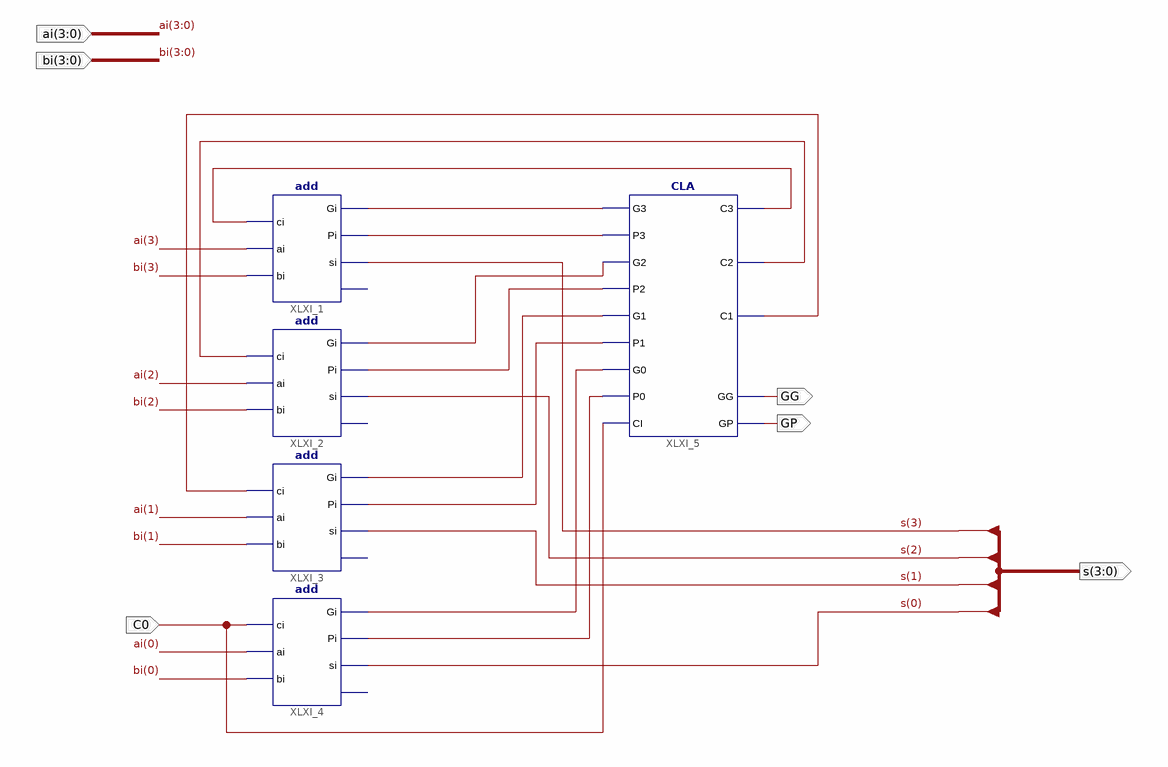
[diagram p0: schematic sheet 1]
// Xilinx ISE schematic ADD4b.sch (kintex7) as structural Verilog: 5 symbols, 6 ports
module ADD4b (
  input  [3:0] bi,
  input  [3:0] ai,
  input  C0,
  output [3:0] s,
  output GG,
  output GP
);

  wire XLXN_35, XLXN_36, XLXN_37, XLXN_38, XLXN_39, XLXN_40, XLXN_41, XLXN_49, XLXN_50, XLXN_51, XLXN_52;

  add XLXI_1 (.Gi(XLXN_35), .Pi(XLXN_36), .si(s[3]), .ai(ai[3]), .bi(bi[3]), .ci(XLXN_37));  // open: co
  add XLXI_2 (.Gi(XLXN_52), .Pi(XLXN_51), .si(s[2]), .ai(ai[2]), .bi(bi[2]), .ci(XLXN_38));  // open: co
  add XLXI_3 (.Gi(XLXN_50), .Pi(XLXN_49), .si(s[1]), .ai(ai[1]), .bi(bi[1]), .ci(XLXN_39));  // open: co
  add XLXI_4 (.Gi(XLXN_41), .Pi(XLXN_40), .si(s[0]), .ai(ai[0]), .bi(bi[0]), .ci(C0));  // open: co
  CLA XLXI_5 (
    .CI(C0), .G0(XLXN_41), .G1(XLXN_50), .G2(XLXN_52), .G3(XLXN_35), .P0(XLXN_40), .P1(XLXN_49),
    .P2(XLXN_51), .P3(XLXN_36), .C1(XLXN_39), .C3(XLXN_37), .C2(XLXN_38), .GG(GG), .GP(GP));
endmodule
